# Altium project NE555-PWM.PRJPCB
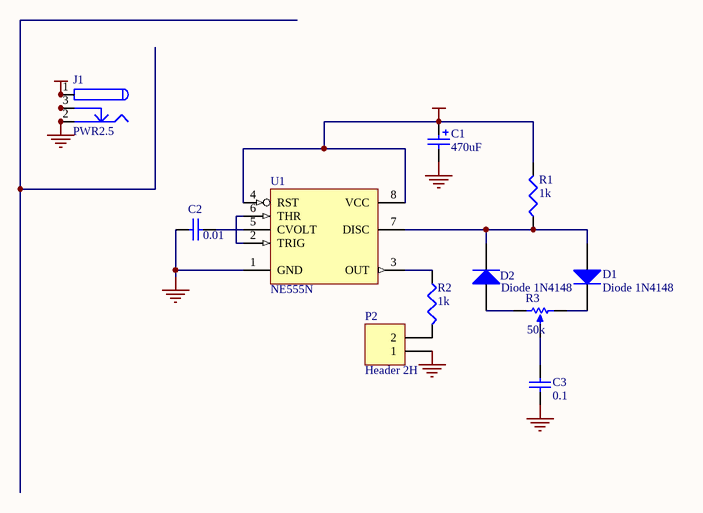
[diagram p0: NE555-PWM.SCHDOC]
1 sheet, 11 parts. Net scope: global (net labels, ports and power ports of the same name join across sheets).
Board file: NE555-PWM.PCBDOC

## Sheet NE555-PWM.SCHDOC
size A4

### Parts
C1  470uF  [POLAR0.8]
C2  0.01  [CC3216-1206]
C3  0.1  [CC3216-1206]
D1  Diode 1N4148  [DIO7.1-3.9x1.9]
D2  Diode 1N4148  [DIO7.1-3.9x1.9]
J1  PWR2.5  [KLD-0202]
P2  Header 2H  [HDR1X2H]
R1  1k  [CR1608-0603]
R2  1k  [CR1608-0603]
R3  50k  [VR5]
U1  NE555N  [DIP8]

### Nets
+5: C1.1 J1.1 J1.1A J1.1B R1.2 U1.4(RST) U1.8(VCC)
GND: C1.2 C2.2 C3.1 J1.2 J1.2A J1.2B P2.1 U1.1(GND)
NetC2_1: C2.1 U1.5(CVOLT)
NetC3_2: C3.2 R3.3(TAP)
NetD1_1: D1.1(A) D2.2(K) R1.1 U1.7(DISC)
NetD1_2: D1.2(K) R3.2(BOT)
NetD2_1: D2.1(A) R3.1(TOP)
NetJ1_3: J1.3 J1.3A J1.3B
NetP2_2: P2.2 R2.2
NetR2_1: R2.1 U1.3(OUT)
NetU1_2: U1.2(TRIG) U1.6(THR)

### Library data of the parts
C1 = Cap Pol2: Polarized Capacitor (Axial); Published: 8-Jun-2000; LatestRevisionDate: 17-Jul-2002; LatestRevisionNote: Re-released for DXP Platform.; Publisher: Altium Limited
C2 C3 = Cap Semi: Capacitor (Semiconductor SIM Model); Published: 8-Jun-2000; LatestRevisionDate: 17-Jul-2002; LatestRevisionNote: Re-released for DXP Platform.; PackageReference: C1206; Publisher: Altium Limited
D1 D2 = Diode 1N4148: High Conductance Fast Diode; Published: 8-Jun-2000; LatestRevisionDate: 17-Jul-2002; LatestRevisionNote: Re-released for DXP Platform.; DatasheetDocument: 1997; PackageReference: DO-35; Publisher: Altium Limited; ComponentLink1Description: Manufacturer Link; ComponentLink1URL: http://www.fairchildsemi.com/; Code_JEDEC: DO-204-AH
J1 = PWR2.5: Low Voltage Power Supply Connector; Published: 17-Dec-2003; DatasheetDocument: 09-May-2002; Publisher: Altium Limited; ComponentLink1Description: Manufacturer Link; ComponentLink1URL: http://domino.kycon.com/internet/Products.html
P2 = Header 2H: Header, 2-Pin, Right Angle; LatestRevisionDate: 17-Jul-2002; LatestRevisionNote: Re-released for DXP Platform.; Publisher: Altium Limited
R1 R2 = Res3: Resistor; Published: 8-Jun-2000; LatestRevisionDate: 4-Mar-2005; LatestRevisionNote: PCB Footprint replaced.; Publisher: Altium Limited
R3 = RPot: Potentiometer; Sim Note: Enter the Resistance value and the set point into parameter fields.; Published: 8-Jun-2000; LatestRevisionDate: 17-Jul-2002; LatestRevisionNote: Re-released for DXP Platform.; Publisher: Altium Limited
U1 = NE555N: General-Purpose Single Bipolar Timer; Published: 24-Aug-2001; LatestRevisionDate: 17-Jul-2002; LatestRevisionNote: Re-released for DXP Platform.; DatasheetDocument: Jul-1998; PackageReference: DIP8; Publisher: Altium Limited; ComponentLink1Description: Manufacturer Link; ComponentLink1URL: http://eu.st.com/; Code_JEDEC: MO-001-AN